# EAGLE design RFID_H2_v4 (EAGLE 9.6.2)
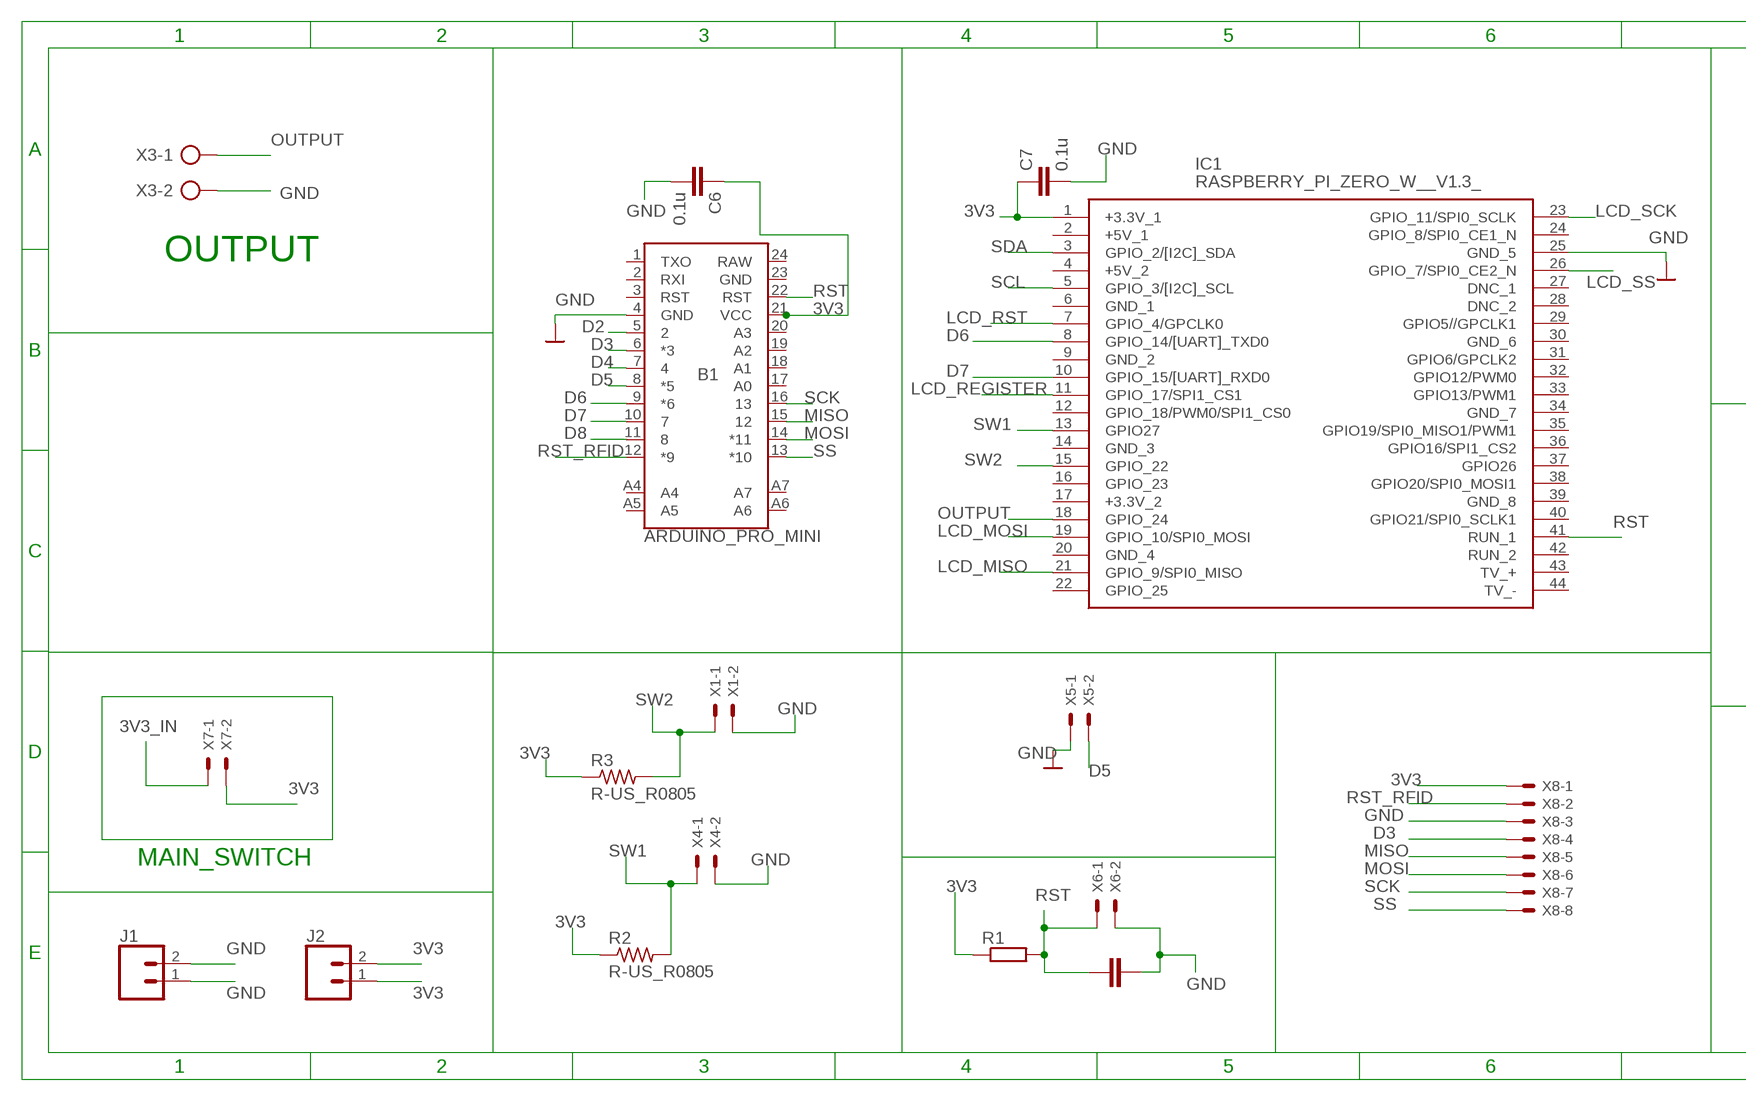
[diagram p0: schematic, sheet 1, part 1 of 2]
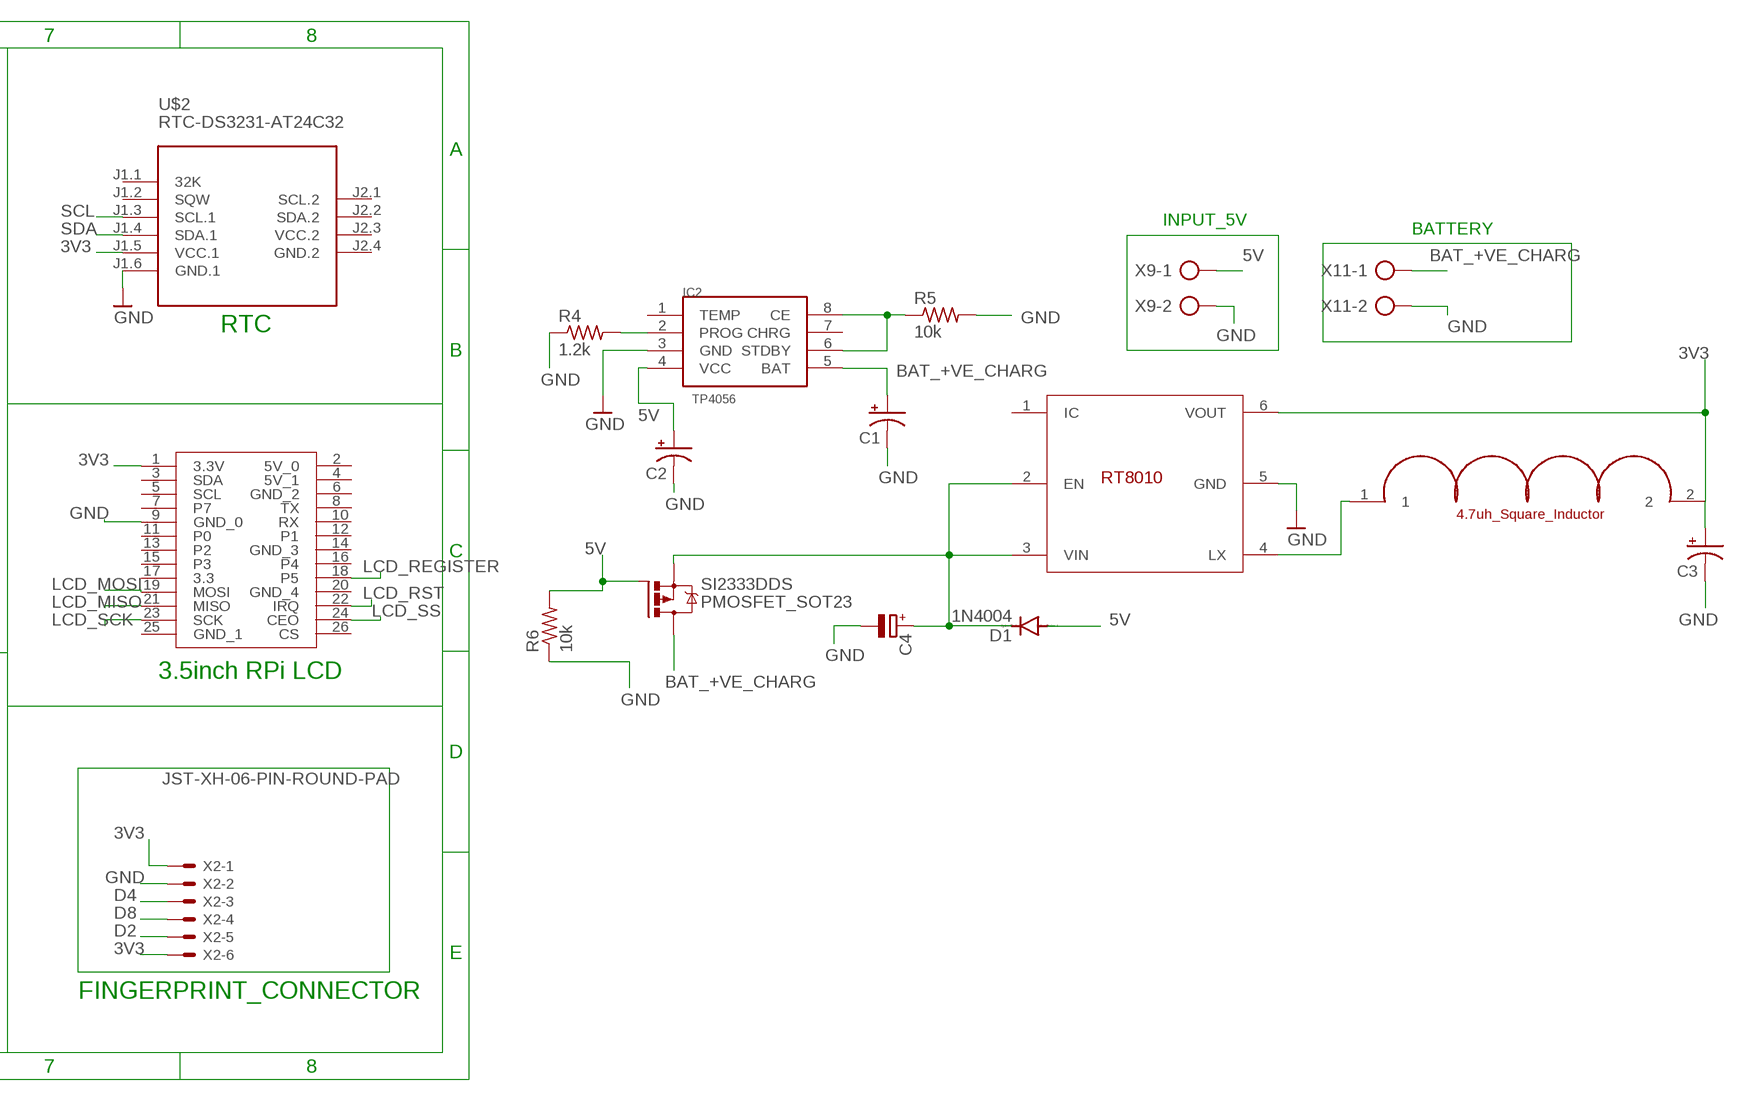
[diagram p1: schematic, sheet 1, part 2 of 2]

## Parts
B1  ARDUINO_PRO_MINI  [ARDUINO_PRO_MINI]
C1  10uf  CAP_POL_10V  [C/6032-28R]
C2  10uf  CAP_POL_10V  [C/6032-28R]
C3  10uf  CAP_POL_10V  [C/6032-28R]
C4  4.7uf  CPOL-EUE2.5-6  [E2,5-6]
C5  10n  C-EUC0805K  [C0805K]
C6  0.1u  C-EUC0805  [C0805]
C7  0.1u  C-EUC0805  [C0805]
D1  1N4004  [DO41-10]
IC1  RASPBERRY_PI_ZERO_W__V1.3_  [RASPBERRYPIZEROWV13]
IC2  TP4056  [SOP-8]
J1  CONN_02  [1X02]
J2  CONN_02  [1X02]
R1  R-EU_0204/5  [0204/5]
R2  R-US_R0805  [R0805]
R3  R-US_R0805  [R0805]
R4  1.2k  R-US_R0805  [R0805]
R5  10k  R-US_R0805  [R0805]
R6  10k  R-US_R0805  [R0805]
SI2333DDS  PMOSFET_SOT23  [SOT23]
U$2  RTC-DS3231-AT24C32  [RTC-DS3231-AT24C32]
U$7  3.5_INCH_TOUCHSCREEN  [FE13-2]
U$9  RT8010_BUCK_CONVERTER  [RT8010]
U$11  INDUCTOR_4.7UH  [INDUCTOR_4.7UH]
X1  JST-XH-02-PIN-LONG-PAD  [JST-XH-02-PACKAGE-LONG-PAD]
X2  JST-XH-06-PIN-ROUND-PAD  [JST-XH-06-PACKAGE-ROUND-PAD]
X3  AK500/2-H  [AK500/2-H]
X4  JST-XH-02-PIN-LONG-PAD  [JST-XH-02-PACKAGE-LONG-PAD]
X5  JST-XH-02-PIN-LONG-PAD  [JST-XH-02-PACKAGE-LONG-PAD]
X6  JST-XH-02-PIN-LONG-PAD  [JST-XH-02-PACKAGE-LONG-PAD]
X7  JST-XH-02-PIN-LONG-PAD  [JST-XH-02-PACKAGE-LONG-PAD]
X8  JST-XH-08-PIN-ROUND-PAD  [JST-XH-08-PACKAGE-ROUND-PAD]
X9  AK500/2-H  [AK500/2-H]
X11  AK500/2-H  [AK500/2-H]

## Nets
3V3: B1.21(VCC) C3.+ C6.1 C7.1 IC1.1(+3.3V_1) J2.1 J2.2 R1.1 R2.1 R3.1 U$2.J1.5(VCC.1) U$7.1(3.3V) U$9.6(VOUT) U$11.2 X2.1 X2.6 X7.2 X8.1
3V3_IN: X7.1
5V: C2.+ D1.A IC2.4(VCC) R6.2 SI2333DDS.1(G) X9.1
BAT_+VE_CHARG: C1.+ IC2.5(BAT) SI2333DDS.3(D) X11.1
D2: B1.5 X2.5
D3: B1.6(*3) X8.4
D4: B1.7 X2.3
D5: B1.8(*5) X5.2
D6: B1.9(*6) IC1.8(GPIO_14/[UART]_TXD0)
D7: B1.10 IC1.10(GPIO_15/[UART]_RXD0)
D8: B1.11 X2.4
GND: B1.4(GND) C1.- C2.- C3.- C4.- C5.1 C6.2 C7.2 IC1.25(GND_5) IC2.3(GND) J1.1 J1.2 R4.1 R5.2 R6.1 U$2.J1.6(GND.1) U$7.9(GND_0) U$9.5(GND) X1.2 X2.2 X3.2 X4.2 X5.1 X6.2 X8.3 X9.2 X11.2
LCD_MISO: IC1.21(GPIO_9/SPI0_MISO) U$7.21(MISO)
LCD_MOSI: IC1.19(GPIO_10/SPI0_MOSI) U$7.19(MOSI)
LCD_REGISTER: IC1.11(GPIO_17/SPI1_CS1) U$7.18(P5)
LCD_RST: IC1.7(GPIO_4/GPCLK0) U$7.22(IRQ)
LCD_SCK: IC1.23(GPIO_11/SPI0_SCLK) U$7.23(SCK)
LCD_SS: IC1.26(GPIO_7/SPI0_CE2_N) U$7.24(CEO)
MISO: B1.15 X8.5
MOSI: B1.14(*11) X8.6
N$4: IC2.2(PROG) R4.2
N$5: IC2.6(STDBY) IC2.8(CE) R5.1
N$6: U$9.4(LX) U$11.1
N$8: C4.+ D1.C SI2333DDS.2(S) U$9.2(EN) U$9.3(VIN)
OUTPUT: IC1.18(GPIO_24) X3.1
RST: B1.22(RST) C5.2 IC1.41(RUN_1) R1.2 X6.1
RST_RFID: B1.12(*9) X8.2
SCK: B1.16 X8.7
SCL: IC1.5(GPIO_3/[I2C]_SCL) U$2.J1.3(SCL.1)
SDA: IC1.3(GPIO_2/[I2C]_SDA) U$2.J1.4(SDA.1)
SS: B1.13(*10) X8.8
SW1: IC1.13(GPIO27) R2.2 X4.1
SW2: IC1.15(GPIO_22) R3.2 X1.1
Unconnected: B1.1(TXO) B1.2(RXI) B1.3(RST) B1.17(A0) B1.18(A1) B1.19(A2) B1.20(A3) B1.A4 B1.A5 B1.A6 B1.A7 IC1.2(+5V_1) IC1.4(+5V_2) IC1.6(GND_1) IC1.9(GND_2) IC1.12(GPIO_18/PWM0/SPI1_CS0) IC1.14(GND_3) IC1.16(GPIO_23) IC1.17(+3.3V_2) IC1.20(GND_4) IC1.22(GPIO_25) IC1.24(GPIO_8/SPI0_CE1_N) IC1.27(DNC_1) IC1.28(DNC_2) IC1.29(GPIO5//GPCLK1) IC1.30(GND_6) IC1.31(GPIO6/GPCLK2) IC1.32(GPIO12/PWM0) IC1.33(GPIO13/PWM1) IC1.34(GND_7) IC1.35(GPIO19/SPI0_MISO1/PWM1) IC1.36(GPIO16/SPI1_CS2) IC1.37(GPIO26) IC1.38(GPIO20/SPI0_MOSI1) IC1.39(GND_8) IC1.40(GPIO21/SPI0_SCLK1) IC1.42(RUN_2) IC1.43(TV_+) IC1.44(TV_-) IC2.1(TEMP) IC2.7(CHRG) U$2.J1.1(32K) U$2.J1.2(SQW) U$2.J2.1(SCL.2) U$2.J2.2(SDA.2) U$7.2(5V_0) U$7.3(SDA) U$7.4(5V_1) U$7.5(SCL) U$7.6(GND_2) U$7.7 U$7.8(TX) U$7.10(RX) U$7.11(P0) U$7.12(P1) U$7.13(P2) U$7.14(GND_3) U$7.15(P3) U$7.16(P4) U$7.17(3.3) U$7.20(GND_4) U$7.25(GND_1) U$7.26(CS) U$9.1(IC)

## Notes on the sheet
- INPUT_5V
- BATTERY
- OUTPUT
- RTC
- 3.5inch RPi LCD
- MAIN_SWITCH
- FINGERPRINT_CONNECTOR

## Power pins joined to a net without a drawn wire
GND: B1.23(GND)
GND.2: U$2.J2.4(GND.2)
RAW: B1.24(RAW)
VCC.2: U$2.J2.3(VCC.2)

## Library data of the parts
B1 = SparkFun-Boards:ARDUINO_PRO_MINI: SparkFun Pro Mini Pro Mini compatible footprint. Dimensions: 0.7 x 1.3" PCB Thickness: 0.8mm SparkFun Products: 3.3V/8MHz <https://www.sparkfun.com/products/11114> 5V/16MHz <https://www.sparkfun.com/products/11113>
C1-C3 = CEDT_JANUARY_2015_v5:CAP_POL
C4 = rcl:CPOL-EU: POLARIZED CAPACITOR, European symbol; SPICEPREFIX: C
C5-C7 = rcl:C-EU: CAPACITOR, European symbol; SPICEPREFIX: C
D1 = diode:1N4004: DIODE general purpose rectifier, 1 A
IC1 = Raspberry_Pi_Zero_W__v1.3_:RASPBERRY_PI_ZERO_W__V1.3_: Raspberry Pi Zero W (v1.3) Single-board Computers Source: Datasheet <https://cdn.sparkfun.com/assets/learn_tutorials/6/7/6/PiZero_1.pdf>; DESCRIPTION: Raspberry Pi Zero W (v1.3) Single-board Computers; HEIGHT: mm; MANUFACTURER_NAME: RASPBERRY-PI; MANUFACTURER_PART_NUMBER: Raspberry Pi Zero W (v1.3)
IC2 = TP4056:TP4056
J1 J2 = SparkFun-Connectors:CONN_02: Multi connection point. Often used as Generic Header-pin footprint for 0.1 inch spaced/style header connections On any of the 0.1 inch spaced packages, you can populate with these: Break Away Headers - Straight <https://www.sparkfun.com/products/116> (PRT-00116) Break Away Male Headers - Right Angle <https://www.sparkfun.com/products/553> (PRT-00553) Female Headers <https://www.sparkfun.com/products/115> (PRT-00115) Break Away Headers - Machine Pin <https://www.sparkfun.com/products/117> (PRT-00117) Break Away Female Headers - Swiss Machine Pin <https://www.sparkfun.com/products/743> (PRT-00743) For SCREWTERMINALS and SPRING TERMINALS visit here: Screw Terimnals on SparkFun.com <https://www.sparkfun.com/search/results?term=Screw+Terminals> (5mm/3.5mm/2.54mm spacing) This device is also useful as a general connection point to wire up your design to another part of your project. Our various solder wires solder well into these plated through hole pads. Hook-Up Wire - Assortment (Stranded, 22 AWG) <https://www.sparkfun.com/products/11375> (PRT-11375) Hook-Up Wire - Assortment (Solid Core, 22 AWG) <https://www.sparkfun.com/products/11367> (PRT-11367) View the entire wire category on our website here <https://www.sparkfun.com/categories/141> Special notes: Molex polarized connector foot print use with: PRT-08233 with associated crimp pins and housings. 2.54_SCREWTERM for use with PRT-10571. 3.5mm Screw Terminal footprints for PRT-08084 5mm Screw Terminal footprints for use with PRT-08432
R1 = resistor:R-EU_: RESISTOR, European symbol
R2 R3 = audio amplifier example:R-US_: RESISTOR, American symbol
R4-R6 = adafruit:R-US_: RESISTOR, American symbol
SI2333DDS = Transistor:PMOSFET: P-Channel MOSFET - Generic; CATEGORY: Transistor; SUB-CATEGORY: MOSFET; TYPE: P-Channel
U$2 = diy-modules:RTC-DS3231-AT24C32: RTC Module with Battery and EEPROM based on DS3231 and AT24C32 chips Tutorial can be found here: https://edwardmallon.wordpress.com/2014/05/21/using-a-cheap-3-ds3231-rtc-at24c32-eeprom-from-ebay/ Click here to find device on ebay.com <http://www.ebay.com/sch/DS3231+AT24C32+module>
U$7 = 3.5_inch_touchscreen:3.5_INCH_TOUCHSCREEN
U$9 = RT8010_buckConverter:RT8010_BUCK_CONVERTER
U$11 = Inductor_4.7uh:INDUCTOR_4.7UH
X1 X4-X7 = Rembrandt Electronics - JST XH Connectors v1-0:JST-XH-02-PIN: JST XH Connector 2 Pin Wire to board connector. Pitch: 2,54 mm, (0.100") Number of pins: 2 Created by Rembrandt Electronics www.rembrandtelectronics.com
X2 = Rembrandt Electronics - JST XH Connectors v1-0:JST-XH-06-PIN: JST XH Connector 2 Pin Wire to board connector. Pitch: 2,54 mm, (0.100") Number of pins: 6 Created by Rembrandt Electronics www.rembrandtelectronics.com
X3 X9 X11 = con-ptr500:AK500/2-H: CONNECTOR Aug. 2004 / PTR Meßtechnik: Die Bezeichnung der Serie AK505 wurde geändert. Es handelt sich hierbei um AK500 in horizontaler Ausführung.; OC_FARNELL: unknown; OC_NEWARK: unknown
X8 = Rembrandt Electronics - JST XH Connectors v1-0:JST-XH-08-PIN: JST XH Connector 2 Pin Wire to board connector. Pitch: 2,54 mm, (0.100") Number of pins: 8 Created by Rembrandt Electronics www.rembrandtelectronics.com

## Board
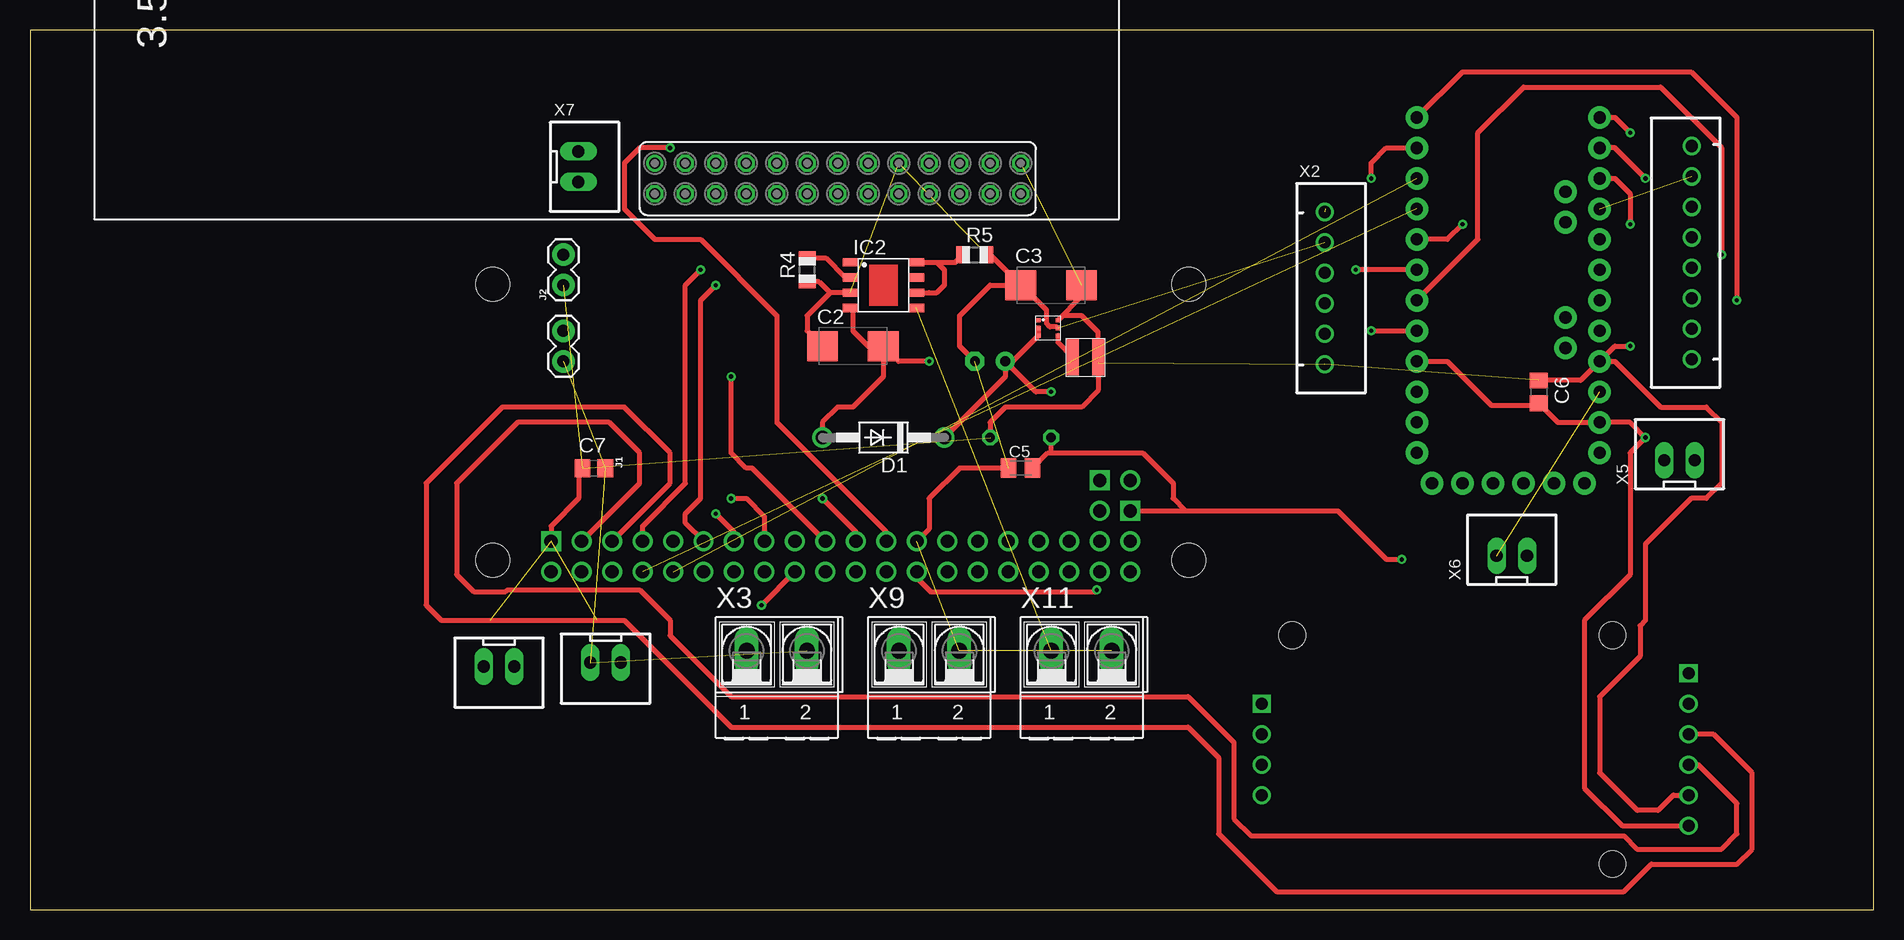
[diagram p2: board, top side]
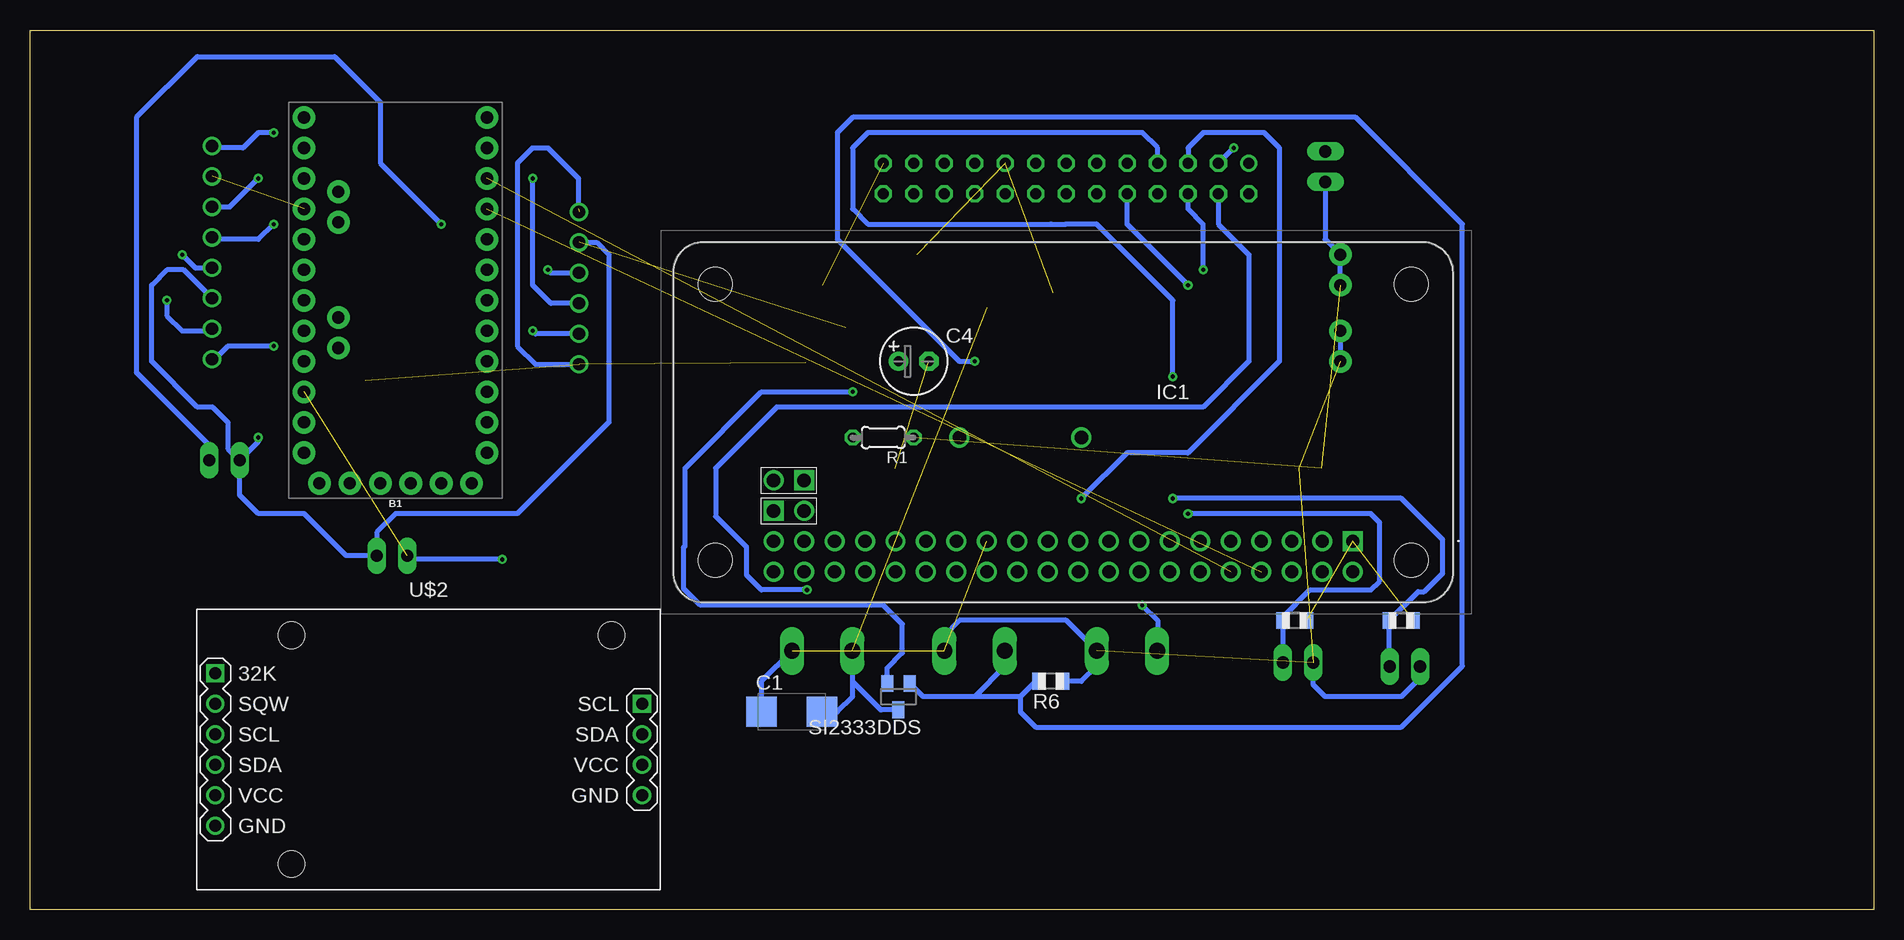
[diagram p3: board, bottom side, seen from below]

Size 153.65 x 73.33 mm. Coordinates in mm from the lower left corner, seen from the top.
Outline: 0,0 153.65,0 153.65,73.33 0,73.33 0,0
Copper layers (1*16): Top 0.035mm / dielectric 1.5mm / Bottom 0.035mm
Design rules "default": minimum track width 6mil, minimum drill 0.35mm, track to track 6mil, track to pad 6mil, pad to pad 6mil, via to via 6mil, smd to smd 6mil, copper to edge 40mil, drill to drill 6mil, minimum pad ring 10mil, minimum via ring 8mil, stop-mask expansion 4mil, vias tented up to drill 0mil, thermal gap 10mil

### Footprints (pad centres in the part's own frame; a part is rotated, then mirrored left to right if it is on the bottom)
ARDUINO_PRO_MINI = drill 1.016 pad 1.88: 1 -7.62,12.7; 2 -7.62,10.16; 3 -7.62,7.62; 4 -7.62,5.08; 5 -7.62,2.54; 6 -7.62,0; 7 -7.62,-2.54; 8 -7.62,-5.08; 9 -7.62,-7.62; 10 -7.62,-10.16; 11 -7.62,-12.7; 12 -7.62,-15.24; 13 7.62,-15.24; 14 7.62,-12.7; 15 7.62,-10.16; 16 7.62,-7.62; 17 7.62,-5.08; 18 7.62,-2.54; 19 7.62,0; 20 7.62,2.54; 21 7.62,5.08; 22 7.62,7.62; 23 7.62,10.16; 24 7.62,12.7; A4 4.763,1.429; A5 4.763,3.969; A6 4.763,-9.049; A7 4.763,-6.509; BLK -6.35,15.24; GND -3.81,15.24; GRN 6.35,15.24; RXI 1.27,15.24; TXO 3.81,15.24; VCC -1.27,15.24
C/6032-28R = smd 2.55 x 2.5: + 2.525,0; - -2.525,0
E2,5-6 = drill 0.813 pad 1.6: + -1.27,0 | drill 0.813 pad 1.6 octagon: - 1.27,0
C0805K = smd 1.3 x 1.6: 1 -1,0; 2 1,0
C0805 = smd 1.3 x 1.5: 1 -0.95,0; 2 0.95,0
DO41-10 = drill 1.118: A 5.08,0; C -5.08,0
RASPBERRYPIZEROWV13 = drill 1.11 pad 1.665 square: 1 -23.885,9.92; 41 24.375,7.38; 43 21.835,4.84 | drill 1.11 pad 1.665: 2 -23.885,12.46; 3 -21.345,9.92; 4 -21.345,12.46; 5 -18.805,9.92; 6 -18.805,12.46; 7 -16.265,9.92; 8 -16.265,12.46; 9 -13.725,9.92; 10 -13.725,12.46; 11 -11.185,9.92; 12 -11.185,12.46; 13 -8.645,9.92; 14 -8.645,12.46; 15 -6.105,9.92; 16 -6.105,12.46; 17 -3.565,9.92; 18 -3.565,12.46; 19 -1.025,9.92; 20 -1.025,12.46; 21 1.515,9.92; 22 1.515,12.46; 23 4.055,9.92; 24 4.055,12.46; 25 6.595,9.92; 26 6.595,12.46; 27 9.135,9.92; 28 9.135,12.46; 29 11.675,9.92; 30 11.675,12.46; 31 14.215,9.92; 32 14.215,12.46; 33 16.755,9.92; 34 16.755,12.46; 35 19.295,9.92; 36 19.295,12.46; 37 21.835,9.92; 38 21.835,12.46; 39 24.375,9.92; 40 24.375,12.46; 42 21.835,7.38; 44 24.375,4.84 | hole 2.8: -28.755,11.5; -28.755,-11.5; 29.245,-11.5; 29.245,11.5
SOP-8 = smd 1.3 x 0.7: 1 -2.75,1.905; 2 -2.75,0.635; 3 -2.75,-0.635; 4 -2.75,-1.905; 5 2.75,-1.905; 6 2.75,-0.635; 7 2.75,0.635; 8 2.75,1.905
1X02 = drill 1.016 pad 1.88: 1 0,0; 2 2.54,0
0204/5 = drill 0.813 octagon: 1 -2.54,0; 2 2.54,0
R0805 = smd 1.1 x 1.4: 1 -1,0; 2 1,0
SOT23 = smd 1 x 1.4: 1 -0.95,-1.1; 2 0.95,-1.1; 3 0,1.1
RTC-DS3231-AT24C32 = drill 1 square: J1.1 -17.78,6.35; J2.1 17.78,3.81 | drill 1: J1.2 -17.78,3.81; J1.3 -17.78,1.27; J1.4 -17.78,-1.27; J1.5 -17.78,-3.81; J1.6 -17.78,-6.35; J2.2 17.78,1.27; J2.3 17.78,-1.27; J2.4 17.78,-3.81 | hole 2.2: -11.43,-9.525; -11.43,9.525; 15.24,9.525
FE13-2 = drill 0.914 octagon: 1 15.24,1.27; 2 15.24,-1.27; 3 12.7,1.27; 4 12.7,-1.27; 5 10.16,1.27; 6 10.16,-1.27; 7 7.62,1.27; 8 7.62,-1.27; 9 5.08,1.27; 10 5.08,-1.27; 11 2.54,1.27; 12 2.54,-1.27; 13 0,1.27; 14 0,-1.27; 15 -2.54,1.27; 16 -2.54,-1.27; 17 -5.08,1.27; 18 -5.08,-1.27; 19 -7.62,1.27; 20 -7.62,-1.27; 21 -10.16,1.27; 22 -10.16,-1.27; 23 -12.7,1.27; 24 -12.7,-1.27; 26 -15.24,-1.27 | drill 0.914: 25 -15.24,1.27
RT8010 = smd 0.35 x 0.4: 1 0.375,0.2; 2 1.025,0.2; 3 1.675,0.2; 4 1.675,1.85; 5 1.025,1.85; 6 0.375,1.85
INDUCTOR_4.7UH = smd 1 x 3: 1 0.55,1.6; 2 2.65,1.6
JST-XH-02-PACKAGE-LONG-PAD = drill 1.016 long: 1 -1.27,0; 2 1.27,0
JST-XH-06-PACKAGE-ROUND-PAD = drill 1.016: 1 -6.35,0; 2 -3.81,0; 3 -1.27,0; 4 1.27,0; 5 3.81,0; 6 6.35,0
AK500/2-H = drill 1.321 long: 1 -2.515,0; 2 2.515,0
JST-XH-08-PACKAGE-ROUND-PAD = drill 1.016: 1 -8.89,0; 2 -6.35,0; 3 -3.81,0; 4 -1.27,0; 5 1.27,0; 6 3.81,0; 7 6.35,0; 8 8.89,0

### Placement (x,y rotation side)
B1  123.19,50.8 180 bottom
C1  90.17,16.51 0 bottom
C2  68.58,46.99 0 top
C3  85.09,52.07 0 top
C4  80.01,45.72 0 bottom
C5  82.55,36.83 0 top
C6  125.73,43.18 270 top
C7  46.99,36.83 0 top
D1  71.12,39.37 180 top
IC1  67.31,40.64 180 bottom
IC2  71.12,52.07 0 top
J1  44.45,45.72 90 top
J2  44.45,52.07 90 top
R1  82.55,39.37 180 bottom
R2  48.26,24.13 180 bottom
R3  39.37,24.13 180 bottom
R4  64.77,53.34 90 top
R5  78.74,54.61 0 top
R6  68.58,19.05 180 bottom
SI2333DDS  81.28,17.78 180 bottom
U$2  120.43,13.37 0 bottom
U$7  67.31,60.96 0 top
U$9  83.82,49.53 270 top
U$11  86.36,44.45 0 top
X1  39.08,20.29 180 top
X2  107.9,51.82 270 top
X3  62.23,21.59 0 top
X4  47.97,20.62 180 top
X5  137.45,37.47 0 top
X6  123.48,29.52 0 top
X7  45.7,61.94 270 top
X8  138.48,54.78 90 top
X9  74.93,21.59 0 top
X11  87.63,21.59 0 top

### Tracks (layer width: path | path; a pad name or v marks a point on that pad's centre or on a via)
3V3  (via drill 0.35)  (8 unrouted)
  Top 0.406: B1.21 132.08,46.99 v133.35,46.99 | C6.1 129.22,44.13 B1.21 | B1.21 132.08,45.72 135.89,41.91 139.7,41.91 140.97,40.64 140.97,35.56 139.7,34.29 138.43,34.29 134.62,30.48 134.62,24.13 134.18,23.69 134.18,21.15 130.81,17.78 130.81,11.43 133.95,8.29 135.67,8.29 136.94,9.56 U$2.J1.5 | C7.1 45.72,36.51 45.72,34.29 43.42,32 IC1.1 | U$11.2 89.01,45.61 | C3.+ 87.61,51.1 U$9.6 86.05,49.53 87.63,49.53 89.01,48.15 U$11.2 | U$11.2 89.01,43.29 87.63,41.91 81.28,41.91 80.01,40.64 R1.1
  Bottom 0.406: v133.35,46.99 137.16,46.99 138.26,45.89 X8.1 | 107.95,58.42 107.95,60.96 110.49,63.5 111.76,63.5 113.03,62.23 113.03,46.99 111.51,45.47 X2.6 | J2.1 J2.2 45.72,55.88 45.7,55.9 X7.2
5V  (via drill 0.35)
  Top 0.406: IC2.4 68.58,49.95 68.58,48.26 69.85,46.99 C2.+ | C2.+ 71.11,44.44 68.58,41.91 67.31,41.91 66.04,40.64 D1.A | v74.93,45.72 72.38,45.72 C2.+
  Bottom 0.406: SI2333DDS.1 79.23,17.78 74.93,17.78 | 74.93,17.78 72.42,20.3 X9.1 | R6.2 69.85,19.05 71.12,17.78 | 71.12,17.78 74.93,17.78 | 71.12,17.78 71.12,16.51 69.85,15.24 39.37,15.24 34.29,20.32 34.29,57.15 43.18,66.04 85.09,66.04 86.36,64.77 86.36,55.88 76.2,45.72 v74.93,45.72
BAT_+VE_CHARG  (1 unrouted)
  Bottom 0.406: X11.1 85.11,19.05 | 85.11,19.05 82.75,16.68 SI2333DDS.3 | 85.11,19.05 85.11,17.8 85.09,17.78 86.36,16.51 C1.+
D2  (via drill 0.35)
  Top 0.406: v111.76,48.26 B1.5
  Bottom 0.406: X2.5 111.51,48.01 v111.76,48.26
D3  (via drill 0.35)
  Top 0.406: B1.6 120.65,55.88 120.65,64.77 124.46,68.58 135.89,68.58 140.97,63.5 v140.97,54.61
  Bottom 0.406: v140.97,54.61 139.87,53.51 X8.4
D4  (via drill 0.35)
  Top 0.406: B1.7 v110.49,53.34
  Bottom 0.406: v110.49,53.34 110.24,53.09 X2.3
D5  (via drill 0.35)
  Top 0.406: v119.38,57.15 118.11,55.88 B1.8
  Bottom 0.406: X5.2 138.72,38.74 144.78,44.8 144.78,66.04 139.7,71.12 128.27,71.12 124.46,67.31 124.46,62.23 v119.38,57.15
D6  (1 unrouted)
D7  (1 unrouted)
D8  (via drill 0.35)
  Top 0.406: v111.76,60.96 111.76,62.23 113.03,63.5 B1.11
  Bottom 0.406: X2.4 110.24,50.55 111.76,52.07 v111.76,60.96
GND  (via drill 0.35)  (9 unrouted)
  Top 0.406: U$2.J1.6 132.68,7.02 129.54,10.16 129.54,24.13 133.35,27.94 133.35,38.1 v134.62,39.37 133.35,40.64 B1.23 127.32,40.64 125.89,42.07 | C6.2 125.89,42.07 | B1.4 118.11,45.72 121.76,42.07 125.89,42.07 | IC1.25 74.93,31.75 74.93,34.29 77.47,36.83 C5.1 | IC2.3 66.67,51.44 | R4.1 65.77,52.34 66.67,51.44 | U$9.5 85.58,48.6 85,48.6 84.71,48.88 84.71,49.99 83.26,51.44 83.26,51.46 82.65,52.07 C3.- | C4.- 77.47,46.99 77.47,49.53 80.01,52.07 C3.- | C3.- 80.03,54.61 R5.2 | C2.- 64.77,48.26 64.77,49.53 66.67,51.44
  Bottom 0.406: X5.1 136.18,34.58 134.62,33.02 130.81,33.02 127.31,29.52 X6.2 124.75,31.46 123.19,33.02 113.03,33.02 105.41,40.64 105.41,54.61 106.43,55.63 X2.2 | X5.1 137.16,38.45 137.16,40.64 138.43,41.91 139.7,41.91 143.51,45.72 143.51,52.07 142.24,53.34 140.85,53.34 X8.3 | X5.1 134.62,39.03 v134.62,39.37 | J1.2 J1.1 | X1.2 37.81,19.34 39.37,17.78 45.72,17.78 46.7,18.76 X4.2 | X11.2 92.69,19.04 C1.- | X9.2 77.44,20.34 77.47,20.32 77.47,22.86 76.2,24.13 67.28,24.13 X3.2 64.77,21.57 64.77,20.32 66.04,19.05 R6.1
LCD_MISO  (via drill 0.35)
  Top 0.406: IC1.21 68.83,31.5 v66.04,34.29
  Bottom 0.406: v66.04,34.29 62.23,38.1 57.15,38.1 49.53,45.72 49.53,63.5 50.8,64.77 55.88,64.77 57.15,63.5 U$7.21
LCD_MOSI  (via drill 0.35)
  Top 0.406: IC1.19 60.17,36.83 59.69,36.83 58.42,38.1 v58.42,44.45
  Bottom 0.406: U$7.19 59.69,63.5 60.96,64.77 83.82,64.77 85.09,63.5 85.09,58.42 83.82,57.15 68.58,57.15 67.31,57.15 64.77,57.15 58.42,50.8 v58.42,44.45
LCD_REGISTER  (via drill 0.35)
  Top 0.406: IC1.11 54.61,32.23 54.61,33.02 55.88,34.29 55.88,50.8 v57.15,52.07
  Bottom 0.406: v57.15,52.07 62.23,57.15 U$7.18
LCD_RST  (via drill 0.35)
  Top 0.406: IC1.7 51.05,31.99 54.61,35.55 54.61,52.07 v55.88,53.34
  Bottom 0.406: v55.88,53.34 55.88,57.15 57.15,58.42 U$7.22
LCD_SCK  (via drill 0.35)
  Top 0.406: v53.34,63.5 50.8,63.5 49.53,62.23 49.53,58.42 52.07,55.88 55.88,55.88 62.23,49.53 62.23,40.64 71.36,31.5 IC1.23
  Bottom 0.406: U$7.23 v53.34,63.5
LCD_SS  (via drill 0.35)
  Top 0.406: IC1.26 73.91,27.7 75.11,26.49 88.72,26.49 v88.9,26.67
  Bottom 0.406: U$7.24 54.61,57.15 52.07,54.61 52.07,45.72 55.88,41.91 91.44,41.91 96.52,36.83 96.52,32.81 93.94,30.23 93.94,27.9 92.71,26.67 v88.9,26.67
MISO  (via drill 0.35)
  Top 0.406: B1.15 132.08,60.96 133.35,59.69 v133.35,57.15
  Bottom 0.406: v133.35,57.15 134.62,55.88 138.31,55.88 X8.5
MOSI  (via drill 0.35)
  Top 0.406: v134.62,60.96 132.08,63.5 B1.14
  Bottom 0.406: X8.6 136.99,58.59 v134.62,60.96
N$4
  Top 0.406: R4.2 66.31,54.34 67.94,52.7 IC2.2
N$5
  Top 0.406: IC2.6 74.93,51.44 75.56,51.44 76.2,52.07 76.2,53.34 75.56,53.98 | IC2.8 75.56,53.98 | 75.56,53.98 77.11,53.98 R5.1
N$6
  Top 0.406: U$11.1 85.67,47.29 U$9.4
N$8  (via drill 0.35)
  Top 0.406: U$9.2 U$9.3 81.89,45.72 C4.+ | C4.+ 81.28,44.45 D1.C | v85.09,43.18 83.82,43.18 C4.+
  Bottom 0.406: SI2333DDS.2 82.23,20.15 80.96,21.42 80.96,23.81 82.55,25.4 97.79,25.4 99.17,26.78 99.17,30.23 99.06,30.34 99.06,36.83 92.71,43.18 v85.09,43.18
OUTPUT  (via drill 0.35)
  Top 0.406: IC1.18 v60.97,25.4 v60.96,25.4
  Bottom 0.406: v60.96,25.4 59.69,24.13 59.69,21.61 X3.1
RST  (via drill 0.35)  (1 unrouted)
  Top 0.406: IC1.41 96.28,33.26 | 96.28,33.26 108.98,33.26 113.03,29.21 v114.3,29.21 | C5.2 84.82,38.1 85.09,38.1 | 85.09,38.1 R1.2 | 85.09,38.1 92.71,38.1 95.25,35.56 95.25,34.29 96.28,33.26
  Bottom 0.406: v114.3,29.21 121.9,29.21 X6.1
RST_RFID  (via drill 0.35)
  Top 0.406: B1.12 119.38,69.85 138.43,69.85 142.24,66.04 v142.24,50.8
  Bottom 0.406: v142.24,50.8 142.24,49.53 140.97,48.26 138.65,48.26 X8.2
SCK  (1 unrouted)
SCL
  Top 0.406: IC1.5 53.34,35.56 53.34,38.1 49.53,41.91 39.37,41.91 33.02,35.56 33.02,25.4 34.29,24.13 49.53,24.13 58.42,15.24 96.52,15.24 99.06,12.7 99.06,6.35 103.88,1.53 132.82,1.53 135.1,3.81 142.24,3.81 143.51,5.08 143.51,11.43 140.3,14.64 U$2.J1.3
SDA
  Top 0.406: IC1.3 50.8,35.55 50.8,38.1 48.26,40.64 40.64,40.64 35.56,35.56 35.56,27.94 36.98,26.52 39.64,26.52 39.79,26.67 50.8,26.67 53.34,24.13 53.34,22.86 58.42,17.78 96.52,17.78 100.33,13.97 100.33,7.62 101.79,6.16 132.82,6.16 133.91,5.08 140.97,5.08 142.24,6.35 142.24,8.89 139.03,12.1 U$2.J1.4
SS  (via drill 0.35)
  Top 0.406: B1.13 132.08,66.04 v133.35,64.77
  Bottom 0.406: v133.35,64.77 134.62,64.77 135.89,63.5 138.31,63.5 X8.8
SW1  (via drill 0.35)
  Top 0.406: v57.15,33.02 58.66,31.5 IC1.13
  Bottom 0.406: X4.1 49.26,20.64 R2.2 49.26,24.4 46.99,26.67 41.91,26.67 41.17,27.41 41.17,32.28 41.91,33.02 v57.15,33.02
SW2  (via drill 0.35)
  Top 0.406: v58.42,34.29 59.69,34.29 61.2,32.77 IC1.15
  Bottom 0.406: X1.1 40.37,20.31 R3.2 37.98,26.52 37.47,26.52 35.94,28.05 35.94,30.86 39.37,34.29 v58.42,34.29